# Altium schematic sheet 02-MCU_01.SchDoc
size A4; SheetNumber: 2; SheetTotal: 4
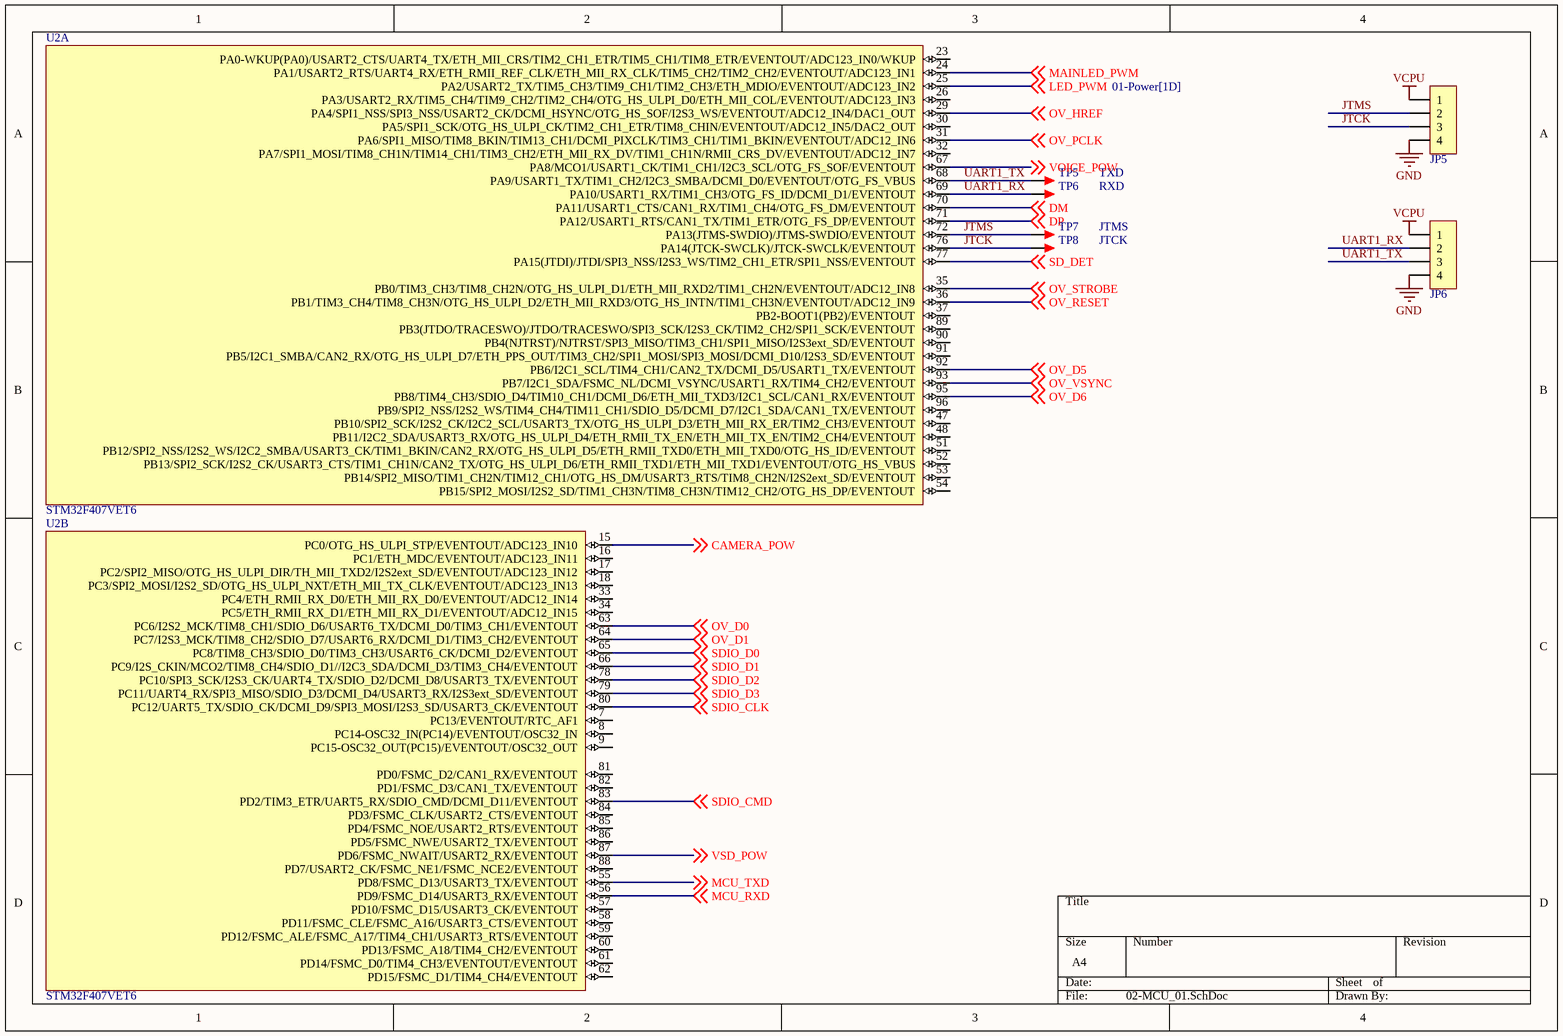
[diagram p0: 02-MCU_01.SchDoc]

## Parts
JP5  HDR-1X4  [MX1.25-LT-4P]  (value not drawn)
JP6  HDR-1X4  [MX1.25-LT-4P]  (value not drawn)
TP5  TXD  [TEST 1.6]
TP6  RXD  [TEST 1.6]
TP7  JTMS  [TEST 1.6]
TP8  JTCK  [TEST 1.6]
U2  STM32F407VET6  [LQFP100_V]  (parts A,B of 5)

## Nets
GND: JP5.4 JP6.4
VCPU: JP5.1 JP6.1
CAMERA_POW: U2.15(PC0/OTG_HS_ULPI_STP/EVENTOUT/ADC123_IN10) ; off-sheet CAMERA_POW
DM: U2.70(PA11/USART1_CTS/CAN1_RX/TIM1_CH4/OTG_FS_DM/EVENTOUT) ; off-sheet DM
DP: U2.71(PA12/USART1_RTS/CAN1_TX/TIM1_ETR/OTG_FS_DP/EVENTOUT) ; off-sheet DP
JTCK: JP5.3 TP8.1 U2.76(PA14(JTCK-SWCLK)/JTCK-SWCLK/EVENTOUT)
JTMS: JP5.2 TP7.1 U2.72(PA13(JTMS-SWDIO)/JTMS-SWDIO/EVENTOUT)
LED_PWM: U2.25(PA2/USART2_TX/TIM5_CH3/TIM9_CH1/TIM2_CH3/ETH_MDIO/EVENTOUT/ADC123_IN2) ; off-sheet LED_PWM
MAINLED_PWM: U2.24(PA1/USART2_RTS/UART4_RX/ETH_RMII_REF_CLK/ETH_MII_RX_CLK/TIM5_CH2/TIM2_CH2/EVENTOUT/ADC123_IN1) ; off-sheet MAINLED_PWM
MCU_RXD: U2.56(PD9/FSMC_D14/USART3_RX/EVENTOUT) ; off-sheet MCU_RXD
MCU_TXD: U2.55(PD8/FSMC_D13/USART3_TX/EVENTOUT) ; off-sheet MCU_TXD
OV_D0: U2.63(PC6/I2S2_MCK/TIM8_CH1/SDIO_D6/USART6_TX/DCMI_D0/TIM3_CH1/EVENTOUT) ; off-sheet OV_D0
OV_D1: U2.64(PC7/I2S3_MCK/TIM8_CH2/SDIO_D7/USART6_RX/DCMI_D1/TIM3_CH2/EVENTOUT) ; off-sheet OV_D1
OV_D5: U2.92(PB6/I2C1_SCL/TIM4_CH1/CAN2_TX/DCMI_D5/USART1_TX/EVENTOUT) ; off-sheet OV_D5
OV_D6: U2.95(PB8/TIM4_CH3/SDIO_D4/TIM10_CH1/DCMI_D6/ETH_MII_TXD3/I2C1_SCL/CAN1_RX/EVENTOUT) ; off-sheet OV_D6
OV_HREF: U2.29(PA4/SPI1_NSS/SPI3_NSS/USART2_CK/DCMI_HSYNC/OTG_HS_SOF/I2S3_WS/EVENTOUT/ADC12_IN4/DAC1_OUT) ; off-sheet OV_HREF
OV_PCLK: U2.31(PA6/SPI1_MISO/TIM8_BKIN/TIM13_CH1/DCMI_PIXCLK/TIM3_CH1/TIM1_BKIN/EVENTOUT/ADC12_IN6) ; off-sheet OV_PCLK
OV_RESET: U2.36(PB1/TIM3_CH4/TIM8_CH3N/OTG_HS_ULPI_D2/ETH_MII_RXD3/OTG_HS_INTN/TIM1_CH3N/EVENTOUT/ADC12_IN9) ; off-sheet OV_RESET
OV_STROBE: U2.35(PB0/TIM3_CH3/TIM8_CH2N/OTG_HS_ULPI_D1/ETH_MII_RXD2/TIM1_CH2N/EVENTOUT/ADC12_IN8) ; off-sheet OV_STROBE
OV_VSYNC: U2.93(PB7/I2C1_SDA/FSMC_NL/DCMI_VSYNC/USART1_RX/TIM4_CH2/EVENTOUT) ; off-sheet OV_VSYNC
SD_DET: U2.77(PA15(JTDI)/JTDI/SPI3_NSS/I2S3_WS/TIM2_CH1_ETR/SPI1_NSS/EVENTOUT) ; off-sheet SD_DET
SDIO_CLK: U2.80(PC12/UART5_TX/SDIO_CK/DCMI_D9/SPI3_MOSI/I2S3_SD/USART3_CK/EVENTOUT) ; off-sheet SDIO_CLK
SDIO_CMD: U2.83(PD2/TIM3_ETR/UART5_RX/SDIO_CMD/DCMI_D11/EVENTOUT) ; off-sheet SDIO_CMD
SDIO_D0: U2.65(PC8/TIM8_CH3/SDIO_D0/TIM3_CH3/USART6_CK/DCMI_D2/EVENTOUT) ; off-sheet SDIO_D0
SDIO_D1: U2.66(PC9/I2S_CKIN/MCO2/TIM8_CH4/SDIO_D1//I2C3_SDA/DCMI_D3/TIM3_CH4/EVENTOUT) ; off-sheet SDIO_D1
SDIO_D2: U2.78(PC10/SPI3_SCK/I2S3_CK/UART4_TX/SDIO_D2/DCMI_D8/USART3_TX/EVENTOUT) ; off-sheet SDIO_D2
SDIO_D3: U2.79(PC11/UART4_RX/SPI3_MISO/SDIO_D3/DCMI_D4/USART3_RX/I2S3ext_SD/EVENTOUT) ; off-sheet SDIO_D3
UART1_RX: JP6.2 TP6.1 U2.69(PA10/USART1_RX/TIM1_CH3/OTG_FS_ID/DCMI_D1/EVENTOUT)
UART1_TX: JP6.3 TP5.1 U2.68(PA9/USART1_TX/TIM1_CH2/I2C3_SMBA/DCMI_D0/EVENTOUT/OTG_FS_VBUS)
VOICE_POW: U2.67(PA8/MCO1/USART1_CK/TIM1_CH1/I2C3_SCL/OTG_FS_SOF/EVENTOUT) ; off-sheet VOICE_POW
VSD_POW: U2.87(PD6/FSMC_NWAIT/USART2_RX/EVENTOUT) ; off-sheet VSD_POW

Not connected (* = marked no-connect by the designer): U2 7(PC13/EVENTOUT/RTC_AF1) 8(PC14-OSC32_IN(PC14)/EVENTOUT/OSC32_IN) 9(PC15-OSC32_OUT(PC15)/EVENTOUT/OSC32_OUT) 16(PC1/ETH_MDC/EVENTOUT/ADC123_IN11) 17(PC2/SPI2_MISO/OTG_HS_ULPI_DIR/TH_MII_TXD2/I2S2ext_SD/EVENTOUT/ADC123_IN12) 18(PC3/SPI2_MOSI/I2S2_SD/OTG_HS_ULPI_NXT/ETH_MII_TX_CLK/EVENTOUT/ADC123_IN13) 23(PA0-WKUP(PA0)/USART2_CTS/UART4_TX/ETH_MII_CRS/TIM2_CH1_ETR/TIM5_CH1/TIM8_ETR/EVENTOUT/ADC123_IN0/WKUP) 26(PA3/USART2_RX/TIM5_CH4/TIM9_CH2/TIM2_CH4/OTG_HS_ULPI_D0/ETH_MII_COL/EVENTOUT/ADC123_IN3) 30(PA5/SPI1_SCK/OTG_HS_ULPI_CK/TIM2_CH1_ETR/TIM8_CHIN/EVENTOUT/ADC12_IN5/DAC2_OUT) 32(PA7/SPI1_MOSI/TIM8_CH1N/TIM14_CH1/TIM3_CH2/ETH_MII_RX_DV/TIM1_CH1N/RMII_CRS_DV/EVENTOUT/ADC12_IN7) 33(PC4/ETH_RMII_RX_D0/ETH_MII_RX_D0/EVENTOUT/ADC12_IN14) 34(PC5/ETH_RMII_RX_D1/ETH_MII_RX_D1/EVENTOUT/ADC12_IN15) 37(PB2-BOOT1(PB2)/EVENTOUT) 47(PB10/SPI2_SCK/I2S2_CK/I2C2_SCL/USART3_TX/OTG_HS_ULPI_D3/ETH_MII_RX_ER/TIM2_CH3/EVENTOUT) 48(PB11/I2C2_SDA/USART3_RX/OTG_HS_ULPI_D4/ETH_RMII_TX_EN/ETH_MII_TX_EN/TIM2_CH4/EVENTOUT) 51(PB12/SPI2_NSS/I2S2_WS/I2C2_SMBA/USART3_CK/TIM1_BKIN/CAN2_RX/OTG_HS_ULPI_D5/ETH_RMII_TXD0/ETH_MII_TXD0/OTG_HS_ID/EVENTOUT) 52(PB13/SPI2_SCK/I2S2_CK/USART3_CTS/TIM1_CH1N/CAN2_TX/OTG_HS_ULPI_D6/ETH_RMII_TXD1/ETH_MII_TXD1/EVENTOUT/OTG_HS_VBUS) 53(PB14/SPI2_MISO/TIM1_CH2N/TIM12_CH1/OTG_HS_DM/USART3_RTS/TIM8_CH2N/I2S2ext_SD/EVENTOUT) 54(PB15/SPI2_MOSI/I2S2_SD/TIM1_CH3N/TIM8_CH3N/TIM12_CH2/OTG_HS_DP/EVENTOUT) 57(PD10/FSMC_D15/USART3_CK/EVENTOUT) 58(PD11/FSMC_CLE/FSMC_A16/USART3_CTS/EVENTOUT) 59(PD12/FSMC_ALE/FSMC_A17/TIM4_CH1/USART3_RTS/EVENTOUT) 60(PD13/FSMC_A18/TIM4_CH2/EVENTOUT) 61(PD14/FSMC_D0/TIM4_CH3/EVENTOUT/EVENTOUT) 62(PD15/FSMC_D1/TIM4_CH4/EVENTOUT) 81(PD0/FSMC_D2/CAN1_RX/EVENTOUT) 82(PD1/FSMC_D3/CAN1_TX/EVENTOUT) 84(PD3/FSMC_CLK/USART2_CTS/EVENTOUT) 85(PD4/FSMC_NOE/USART2_RTS/EVENTOUT) 86(PD5/FSMC_NWE/USART2_TX/EVENTOUT) 88(PD7/USART2_CK/FSMC_NE1/FSMC_NCE2/EVENTOUT) 89(PB3(JTDO/TRACESWO)/JTDO/TRACESWO/SPI3_SCK/I2S3_CK/TIM2_CH2/SPI1_SCK/EVENTOUT) 90(PB4(NJTRST)/NJTRST/SPI3_MISO/TIM3_CH1/SPI1_MISO/I2S3ext_SD/EVENTOUT) 91(PB5/I2C1_SMBA/CAN2_RX/OTG_HS_ULPI_D7/ETH_PPS_OUT/TIM3_CH2/SPI1_MOSI/SPI3_MOSI/DCMI_D10/I2S3_SD/EVENTOUT) 96(PB9/SPI2_NSS/I2S2_WS/TIM4_CH4/TIM11_CH1/SDIO_D5/DCMI_D7/I2C1_SDA/CAN1_TX/EVENTOUT)

## Library data of the parts
JP5 JP6 = Header 4: 4P连接器; 联系卖家 免费技术支持: 封装库来自淘宝卖家ID：黄晶宝石; BOM名称: 4P连接器
TP5-TP8 = TEST: 测试点; 联系下单店铺卖家 免费技术支持: 联系下单店铺卖家 免费帮你查找封装; BOM名称: 测试点
U2 = STM32F407VET6: ARM Cortex-M4 32b MCU+FPU, 210DMIP, 512 kB Flash, 192+4 kB RAM, Camera, 82 I/Os, 100-pin LQFP, -40 to +85癈, Tray; Internal RAM: 192kB; Operating Frequency (Processor Speed): 168MHz; A/D Converter: 16x12-bit; D/A Converter: 2x12-bit; 16-bit Timers (IC/OC/PWM): 12x16-bit(24/24/30); 32-bit Timer (IC/OC/PWM): 2x32-bit (8/8/8); Other Timer Functions: 2xWDG, RTC, 24-bit down counter; Serial Interface: 3xSPI/2xI2S/2xI2C/3xUSART(IrDa, ISO7816)/3xUART/2xUSB OTG FS/HS, 2xCAN/Ethernet MAC10/100, SDIO; DatasheetVersion: rev2, Jan-2012; PackageVersion: 2012; PackageReference: LQFP100; PackageDescription: 100-Pin Low Profile Quad Flat Package, 14x14 mm Body, 0.5 mm Pitch; ComponentLink1Description: Manufacturer URL; ComponentLink1URL: http://www.st.com/; ComponentLink2Description: STM32F405/7 Datasheet; ComponentLink2URL: http://www.st.com/internet/com/TECHNICAL_RESOURCES/TECHNICAL_LITERATURE/DATASHEET/DM00037051.pdf; ComponentLink3Description: STM32F4 Web Page; ComponentLink3URL: http://www.st.com/internet/mcu/subclass/1521.jsp